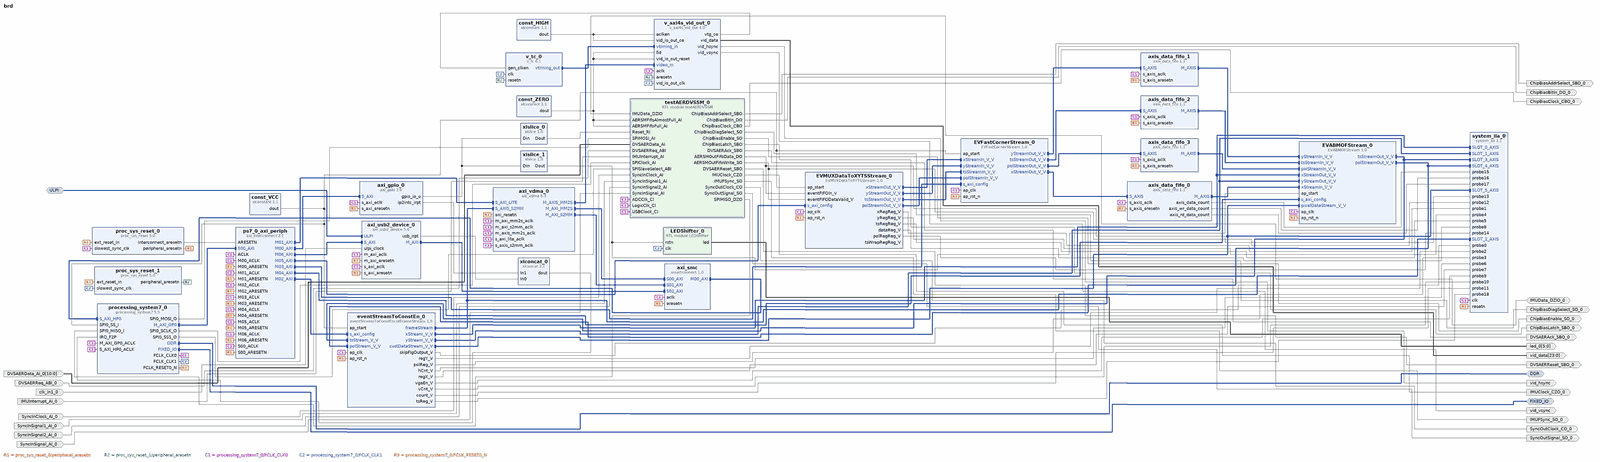
[diagram p0: block diagram of the top level, whole]
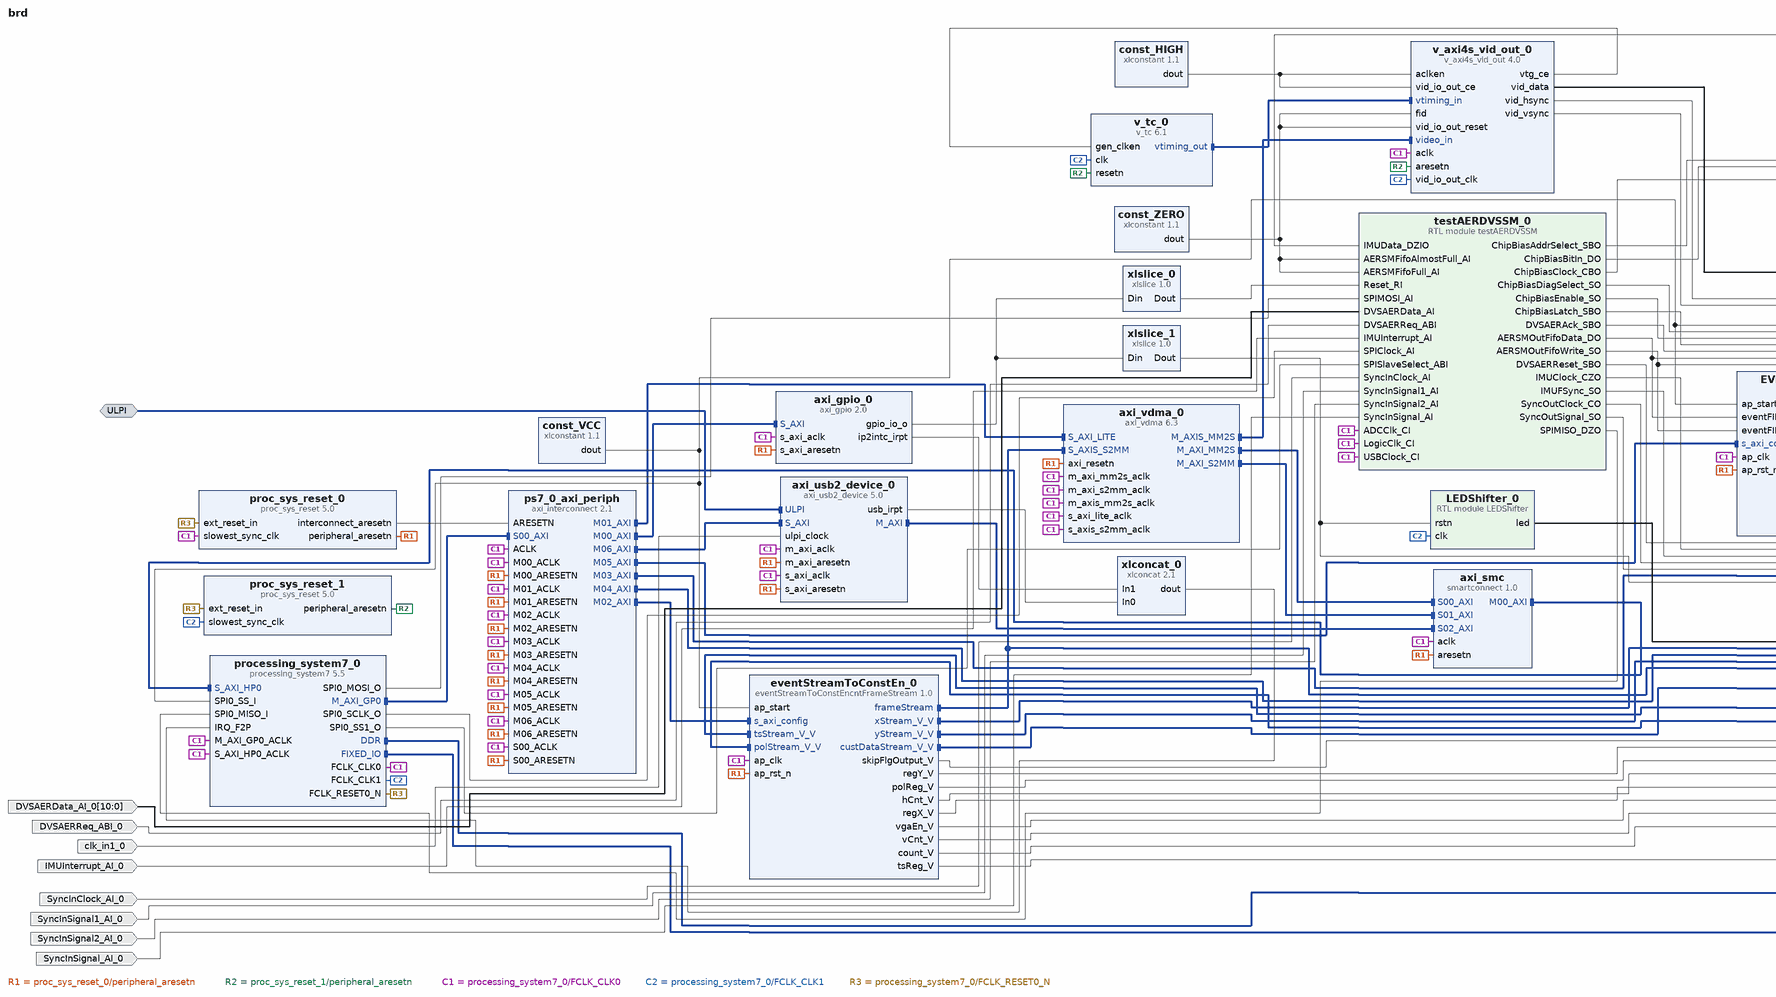
[diagram p1: block diagram of the top level, left part]
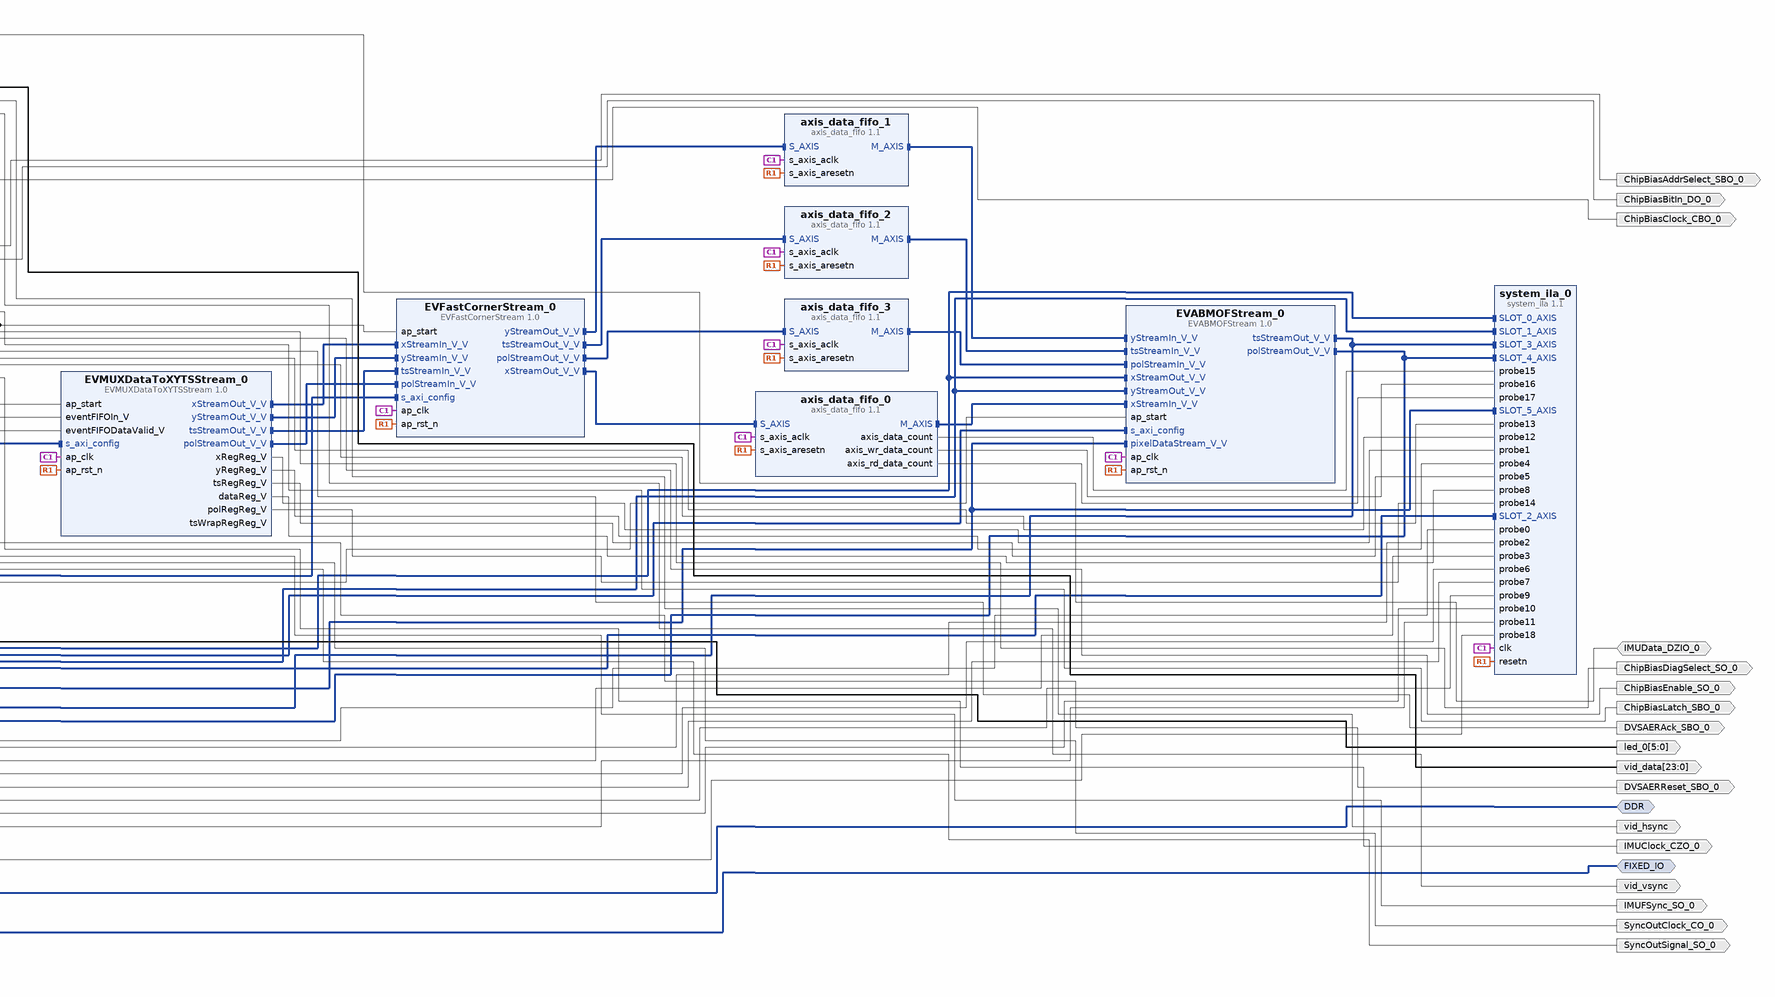
[diagram p2: block diagram of the top level, right part]
# Vivado block design brd, xc7z045ffg900-1, Vivado 2018.1
create_bd_design brd

create_bd_intf_port -mode Master -vlnv xilinx.com:interface:ddrx_rtl:1.0 DDR
create_bd_intf_port -mode Master -vlnv xilinx.com:display_processing_system7:fixedio_rtl:1.0 FIXED_IO
create_bd_intf_port -mode Slave -vlnv xilinx.com:interface:ulpi_rtl:1.0 ULPI
create_bd_port -dir I -from 10 -to 0 DVSAERData_AI_0
create_bd_port -dir I DVSAERReq_ABI_0
create_bd_port -dir I IMUInterrupt_AI_0
create_bd_port -dir O -from 5 -to 0 led_0
create_bd_port -dir IO IMUData_DZIO_0
create_bd_port -dir I SyncInClock_AI_0
create_bd_port -dir I SyncInSignal1_AI_0
create_bd_port -dir I SyncInSignal2_AI_0
create_bd_port -dir I SyncInSignal_AI_0
create_bd_port -dir O ChipBiasAddrSelect_SBO_0
create_bd_port -dir O ChipBiasBitIn_DO_0
create_bd_port -dir O ChipBiasClock_CBO_0
create_bd_port -dir O ChipBiasDiagSelect_SO_0
create_bd_port -dir O ChipBiasEnable_SO_0
create_bd_port -dir O ChipBiasLatch_SBO_0
create_bd_port -dir O DVSAERAck_SBO_0
create_bd_port -dir O DVSAERReset_SBO_0
create_bd_port -dir O IMUClock_CZO_0
create_bd_port -dir O IMUFSync_SO_0
create_bd_port -dir O SyncOutClock_CO_0
create_bd_port -dir O SyncOutSignal_SO_0
create_bd_port -dir O -from 23 -to 0 vid_data
create_bd_port -dir O vid_hsync
create_bd_port -dir O vid_vsync
create_bd_port -dir I -type clk clk_in1_0
set_property -dict {CONFIG.FREQ_HZ 60000000} [get_bd_ports clk_in1_0]

create_bd_cell -type ip -vlnv xilinx.com:ip:axi_gpio:2.0 axi_gpio_0
set_property -dict [list \
  CONFIG.C_GPIO_WIDTH 32 \
  CONFIG.C_IS_DUAL 0 \
  CONFIG.C_DOUT_DEFAULT 0x00000006 \
  CONFIG.C_INTERRUPT_PRESENT 1 \
  CONFIG.C_ALL_OUTPUTS 1 \
] [get_bd_cells axi_gpio_0]
create_bd_cell -type ip -vlnv xilinx.com:ip:axi_vdma:6.3 axi_vdma_0
set_property -dict {CONFIG.c_m_axis_mm2s_tdata_width 24} [get_bd_cells axi_vdma_0]
create_bd_cell -type ip -vlnv xilinx.com:ip:xlconstant:1.1 const_HIGH
create_bd_cell -type ip -vlnv xilinx.com:ip:xlconstant:1.1 const_VCC
create_bd_cell -type ip -vlnv xilinx.com:ip:proc_sys_reset:5.0 proc_sys_reset_0
create_bd_cell -type ip -vlnv xilinx.com:ip:proc_sys_reset:5.0 proc_sys_reset_1
create_bd_cell -type ip -vlnv xilinx.com:ip:processing_system7:5.5 processing_system7_0
set_property -dict [list \
  CONFIG.PCW_FCLK_CLK1_BUF TRUE \
  CONFIG.PCW_FCLK_CLK2_BUF TRUE \
  CONFIG.PCW_UIPARAM_DDR_FREQ_MHZ 533.333333 \
  CONFIG.PCW_CRYSTAL_PERIPHERAL_FREQMHZ 50 \
  CONFIG.PCW_APU_PERIPHERAL_FREQMHZ 666.666666 \
  CONFIG.PCW_SDIO_PERIPHERAL_FREQMHZ 100 \
  CONFIG.PCW_UART_PERIPHERAL_FREQMHZ 100 \
  CONFIG.PCW_SPI_PERIPHERAL_FREQMHZ 125 \
  CONFIG.PCW_I2C_PERIPHERAL_FREQMHZ 108.333336 \
  CONFIG.PCW_FPGA0_PERIPHERAL_FREQMHZ 100 \
  CONFIG.PCW_FPGA1_PERIPHERAL_FREQMHZ 40 \
  CONFIG.PCW_FPGA2_PERIPHERAL_FREQMHZ 250 \
  CONFIG.PCW_USE_S_AXI_HP0 1 \
  CONFIG.PCW_USE_FABRIC_INTERRUPT 1 \
  CONFIG.PCW_EN_CLK1_PORT 1 \
  CONFIG.PCW_EN_CLK2_PORT 1 \
  CONFIG.PCW_IRQ_F2P_INTR 1 \
  CONFIG.PCW_PERIPHERAL_BOARD_PRESET None \
  CONFIG.PCW_PRESET_BANK1_VOLTAGE {LVCMOS 3.3V} \
  CONFIG.PCW_UIPARAM_DDR_BUS_WIDTH {16 Bit} \
  CONFIG.PCW_UIPARAM_DDR_PARTNO Custom \
  CONFIG.PCW_NAND_PERIPHERAL_ENABLE 1 \
  CONFIG.PCW_NAND_NAND_IO {MIO 0 2.. 14} \
  CONFIG.PCW_ENET0_PERIPHERAL_ENABLE 0 \
  CONFIG.PCW_SD0_PERIPHERAL_ENABLE 1 \
  CONFIG.PCW_SD0_SD0_IO {MIO 16 .. 21} \
  CONFIG.PCW_SD0_GRP_CD_ENABLE 0 \
  CONFIG.PCW_SD0_GRP_WP_ENABLE 0 \
  CONFIG.PCW_UART0_PERIPHERAL_ENABLE 1 \
  CONFIG.PCW_UART0_UART0_IO {MIO 22 .. 23} \
  CONFIG.PCW_UART1_PERIPHERAL_ENABLE 0 \
  CONFIG.PCW_SPI0_PERIPHERAL_ENABLE 1 \
  CONFIG.PCW_SPI0_SPI0_IO EMIO \
  CONFIG.PCW_USB0_PERIPHERAL_ENABLE 1 \
  CONFIG.PCW_USB0_USB0_IO {MIO 28 .. 39} \
  CONFIG.PCW_USB1_PERIPHERAL_ENABLE 1 \
  CONFIG.PCW_USB1_USB1_IO {MIO 40 .. 51} \
  CONFIG.PCW_I2C0_PERIPHERAL_ENABLE 1 \
  CONFIG.PCW_I2C0_I2C0_IO {MIO 26 .. 27} \
  CONFIG.PCW_I2C0_GRP_INT_ENABLE 0 \
  CONFIG.PCW_I2C1_PERIPHERAL_ENABLE 1 \
  CONFIG.PCW_I2C1_I2C1_IO EMIO \
  CONFIG.PCW_GPIO_MIO_GPIO_ENABLE 0 \
  CONFIG.PCW_FPGA_FCLK1_ENABLE 1 \
  CONFIG.PCW_FPGA_FCLK2_ENABLE 1 \
] [get_bd_cells processing_system7_0]
# 491 more settings of processing_system7_0 are not shown: defaults, MIO pin electricals, DDR timing, and values the tool derives
create_bd_cell -type ip -vlnv xilinx.com:ip:axi_interconnect:2.1 ps7_0_axi_periph
set_property -dict {CONFIG.NUM_SI 1 CONFIG.NUM_MI 7} [get_bd_cells ps7_0_axi_periph]
create_bd_cell -type ip -vlnv xilinx.com:ip:v_axi4s_vid_out:4.0 v_axi4s_vid_out_0
set_property -dict {CONFIG.C_HAS_ASYNC_CLK 1} [get_bd_cells v_axi4s_vid_out_0]
create_bd_cell -type ip -vlnv xilinx.com:ip:v_tc:6.1 v_tc_0
set_property -dict {CONFIG.HAS_AXI4_LITE false CONFIG.VIDEO_MODE 800x600p CONFIG.enable_detection false} [get_bd_cells v_tc_0]
create_bd_cell -type ip -vlnv xilinx.com:ip:xlslice:1.0 xlslice_0
create_bd_cell -type ip -vlnv xilinx.com:ip:xlslice:1.0 xlslice_1
set_property -dict {CONFIG.DIN_TO 1 CONFIG.DIN_FROM 1 CONFIG.DOUT_WIDTH 1} [get_bd_cells xlslice_1]
create_bd_cell -type ip -vlnv xilinx.com:ip:xlconstant:1.1 const_ZERO
set_property -dict {CONFIG.CONST_VAL 0} [get_bd_cells const_ZERO]
create_bd_cell -type module -reference LEDShifter LEDShifter_0
create_bd_cell -type ip -vlnv xilinx.com:ip:smartconnect:1.0 axi_smc
set_property -dict {CONFIG.NUM_SI 3} [get_bd_cells axi_smc]
create_bd_cell -type module -reference testAERDVSSM testAERDVSSM_0
create_bd_cell -type ip -vlnv xilinx.com:ip:system_ila:1.1 system_ila_0
set_property -dict [list \
  CONFIG.C_SLOT_0_APC_EN 0 \
  CONFIG.C_SLOT_1_APC_EN 0 \
  CONFIG.C_SLOT_2_APC_EN 0 \
  CONFIG.C_SLOT_3_APC_EN 0 \
  CONFIG.C_SLOT_4_APC_EN 0 \
  CONFIG.C_SLOT_5_APC_EN 0 \
  CONFIG.C_SLOT_6_APC_EN 0 \
  CONFIG.C_SLOT_0_AXI_DATA_SEL 1 \
  CONFIG.C_SLOT_1_AXI_DATA_SEL 1 \
  CONFIG.C_SLOT_2_AXI_DATA_SEL 1 \
  CONFIG.C_SLOT_3_AXI_DATA_SEL 1 \
  CONFIG.C_SLOT_4_AXI_DATA_SEL 1 \
  CONFIG.C_SLOT_5_AXI_DATA_SEL 1 \
  CONFIG.C_SLOT_6_AXI_DATA_SEL 1 \
  CONFIG.C_SLOT_0_AXI_TRIG_SEL 1 \
  CONFIG.C_SLOT_1_AXI_TRIG_SEL 1 \
  CONFIG.C_SLOT_2_AXI_TRIG_SEL 1 \
  CONFIG.C_SLOT_3_AXI_TRIG_SEL 1 \
  CONFIG.C_SLOT_4_AXI_TRIG_SEL 1 \
  CONFIG.C_SLOT_5_AXI_TRIG_SEL 1 \
  CONFIG.C_SLOT_6_AXI_TRIG_SEL 1 \
  CONFIG.C_PROBE18_TYPE 0 \
  CONFIG.C_PROBE17_TYPE 0 \
  CONFIG.C_PROBE16_TYPE 0 \
  CONFIG.C_PROBE15_TYPE 0 \
  CONFIG.C_PROBE14_TYPE 0 \
  CONFIG.C_PROBE11_TYPE 0 \
  CONFIG.C_PROBE10_TYPE 0 \
  CONFIG.C_PROBE9_TYPE 0 \
  CONFIG.C_PROBE8_TYPE 0 \
  CONFIG.C_PROBE7_TYPE 0 \
  CONFIG.C_PROBE6_TYPE 0 \
  CONFIG.C_PROBE5_TYPE 0 \
  CONFIG.C_PROBE4_TYPE 0 \
  CONFIG.C_PROBE3_TYPE 0 \
  CONFIG.C_PROBE2_TYPE 0 \
  CONFIG.C_PROBE1_TYPE 0 \
  CONFIG.C_PROBE0_TYPE 0 \
  CONFIG.C_DATA_DEPTH 16384 \
  CONFIG.C_NUM_OF_PROBES 19 \
  CONFIG.C_NUM_MONITOR_SLOTS 6 \
  CONFIG.C_SLOT_0_INTF_TYPE xilinx.com:interface:axis_rtl:1.0 \
  CONFIG.C_SLOT_1_INTF_TYPE xilinx.com:interface:axis_rtl:1.0 \
  CONFIG.C_SLOT_2_INTF_TYPE xilinx.com:interface:axis_rtl:1.0 \
  CONFIG.C_SLOT_3_INTF_TYPE xilinx.com:interface:axis_rtl:1.0 \
  CONFIG.C_SLOT_4_INTF_TYPE xilinx.com:interface:axis_rtl:1.0 \
  CONFIG.C_SLOT_5_INTF_TYPE xilinx.com:interface:axis_rtl:1.0 \
  CONFIG.C_SLOT_6_INTF_TYPE xilinx.com:interface:axis_rtl:1.0 \
  CONFIG.C_MON_TYPE MIX \
] [get_bd_cells system_ila_0]
create_bd_cell -type ip -vlnv xilinx.com:ip:axis_data_fifo:1.1 axis_data_fifo_0
set_property -dict {CONFIG.FIFO_DEPTH 4096} [get_bd_cells axis_data_fifo_0]
create_bd_cell -type ip -vlnv xilinx.com:ip:axis_data_fifo:1.1 axis_data_fifo_1
set_property -dict {CONFIG.FIFO_DEPTH 4096} [get_bd_cells axis_data_fifo_1]
create_bd_cell -type ip -vlnv xilinx.com:ip:axis_data_fifo:1.1 axis_data_fifo_2
set_property -dict {CONFIG.FIFO_DEPTH 4096} [get_bd_cells axis_data_fifo_2]
create_bd_cell -type ip -vlnv xilinx.com:ip:axis_data_fifo:1.1 axis_data_fifo_3
set_property -dict {CONFIG.FIFO_DEPTH 4096} [get_bd_cells axis_data_fifo_3]
create_bd_cell -type ip -vlnv xilinx.com:hls:EVMUXDataToXYTSStream:1.0 EVMUXDataToXYTSStream_0
create_bd_cell -type ip -vlnv xilinx.com:hls:EVFastCornerStream:1.0 EVFastCornerStream_0
create_bd_cell -type ip -vlnv xilinx.com:hls:EVABMOFStream:1.0 EVABMOFStream_0
create_bd_cell -type ip -vlnv xilinx.com:ip:axi_usb2_device:5.0 axi_usb2_device_0
set_property -dict [list \
  CONFIG.C_INCLUDE_DMA 1 \
  CONFIG.C_DMA_UA_TRANS_SUPPORT 1 \
  CONFIG.C_INCLUDE_USBERR_LOGIC 1 \
] [get_bd_cells axi_usb2_device_0]
create_bd_cell -type ip -vlnv xilinx.com:ip:xlconcat:2.1 xlconcat_0
create_bd_cell -type ip -vlnv xilinx.com:hls:eventStreamToConstEncntFrameStream:1.0 eventStreamToConstEn_0

# ---- connections ----

connect_bd_intf_net [get_bd_intf_pins processing_system7_0/M_AXI_GP0] [get_bd_intf_pins ps7_0_axi_periph/S00_AXI]
connect_bd_intf_net [get_bd_intf_pins ps7_0_axi_periph/M00_AXI] [get_bd_intf_pins axi_gpio_0/S_AXI]
connect_bd_intf_net [get_bd_intf_pins ps7_0_axi_periph/M01_AXI] [get_bd_intf_pins axi_vdma_0/S_AXI_LITE]
connect_bd_intf_net [get_bd_intf_pins v_axi4s_vid_out_0/vtiming_in] [get_bd_intf_pins v_tc_0/vtiming_out]
connect_bd_intf_net [get_bd_intf_pins axi_vdma_0/S_AXIS_S2MM] [get_bd_intf_pins eventStreamToConstEn_0/frameStream]
connect_bd_intf_net [get_bd_intf_pins axi_vdma_0/S_AXIS_S2MM] [get_bd_intf_pins system_ila_0/SLOT_2_AXIS]
connect_bd_intf_net [get_bd_intf_pins v_axi4s_vid_out_0/video_in] [get_bd_intf_pins axi_vdma_0/M_AXIS_MM2S]
connect_bd_intf_net [get_bd_intf_pins axi_vdma_0/M_AXI_MM2S] [get_bd_intf_pins axi_smc/S00_AXI]
connect_bd_intf_net [get_bd_intf_pins axi_smc/M00_AXI] [get_bd_intf_pins processing_system7_0/S_AXI_HP0]
connect_bd_intf_net [get_bd_intf_pins axi_vdma_0/M_AXI_S2MM] [get_bd_intf_pins axi_smc/S01_AXI]
connect_bd_intf_net [get_bd_intf_pins ps7_0_axi_periph/M02_AXI] [get_bd_intf_pins eventStreamToConstEn_0/s_axi_config]
connect_bd_intf_net [get_bd_intf_pins EVMUXDataToXYTSStream_0/xStreamOut_V_V] [get_bd_intf_pins EVFastCornerStream_0/xStreamIn_V_V]
connect_bd_intf_net [get_bd_intf_pins EVMUXDataToXYTSStream_0/yStreamOut_V_V] [get_bd_intf_pins EVFastCornerStream_0/yStreamIn_V_V]
connect_bd_intf_net [get_bd_intf_pins EVMUXDataToXYTSStream_0/tsStreamOut_V_V] [get_bd_intf_pins EVFastCornerStream_0/tsStreamIn_V_V]
connect_bd_intf_net [get_bd_intf_pins EVMUXDataToXYTSStream_0/polStreamOut_V_V] [get_bd_intf_pins EVFastCornerStream_0/polStreamIn_V_V]
connect_bd_intf_net [get_bd_intf_pins ps7_0_axi_periph/M03_AXI] [get_bd_intf_pins EVFastCornerStream_0/s_axi_config]
connect_bd_intf_net [get_bd_intf_pins ps7_0_axi_periph/M04_AXI] [get_bd_intf_pins EVABMOFStream_0/s_axi_config]
connect_bd_intf_net [get_bd_intf_pins eventStreamToConstEn_0/xStream_V_V] [get_bd_intf_pins EVABMOFStream_0/xStreamOut_V_V]
connect_bd_intf_net [get_bd_intf_pins eventStreamToConstEn_0/xStream_V_V] [get_bd_intf_pins system_ila_0/SLOT_0_AXIS]
connect_bd_intf_net [get_bd_intf_pins eventStreamToConstEn_0/yStream_V_V] [get_bd_intf_pins EVABMOFStream_0/yStreamOut_V_V]
connect_bd_intf_net [get_bd_intf_pins eventStreamToConstEn_0/yStream_V_V] [get_bd_intf_pins system_ila_0/SLOT_1_AXIS]
connect_bd_intf_net [get_bd_intf_pins EVABMOFStream_0/tsStreamOut_V_V] [get_bd_intf_pins eventStreamToConstEn_0/tsStream_V_V]
connect_bd_intf_net [get_bd_intf_pins EVABMOFStream_0/tsStreamOut_V_V] [get_bd_intf_pins system_ila_0/SLOT_3_AXIS]
connect_bd_intf_net [get_bd_intf_pins EVABMOFStream_0/polStreamOut_V_V] [get_bd_intf_pins eventStreamToConstEn_0/polStream_V_V]
connect_bd_intf_net [get_bd_intf_pins EVABMOFStream_0/polStreamOut_V_V] [get_bd_intf_pins system_ila_0/SLOT_4_AXIS]
connect_bd_intf_net [get_bd_intf_pins eventStreamToConstEn_0/custDataStream_V_V] [get_bd_intf_pins EVABMOFStream_0/pixelDataStream_V_V]
connect_bd_intf_net [get_bd_intf_pins eventStreamToConstEn_0/custDataStream_V_V] [get_bd_intf_pins system_ila_0/SLOT_5_AXIS]
connect_bd_intf_net [get_bd_intf_pins EVFastCornerStream_0/xStreamOut_V_V] [get_bd_intf_pins axis_data_fifo_0/S_AXIS]
connect_bd_intf_net [get_bd_intf_pins EVFastCornerStream_0/yStreamOut_V_V] [get_bd_intf_pins axis_data_fifo_1/S_AXIS]
connect_bd_intf_net [get_bd_intf_pins EVFastCornerStream_0/tsStreamOut_V_V] [get_bd_intf_pins axis_data_fifo_2/S_AXIS]
connect_bd_intf_net [get_bd_intf_pins EVFastCornerStream_0/polStreamOut_V_V] [get_bd_intf_pins axis_data_fifo_3/S_AXIS]
connect_bd_intf_net [get_bd_intf_pins axis_data_fifo_0/M_AXIS] [get_bd_intf_pins EVABMOFStream_0/xStreamIn_V_V]
connect_bd_intf_net [get_bd_intf_pins axis_data_fifo_1/M_AXIS] [get_bd_intf_pins EVABMOFStream_0/yStreamIn_V_V]
connect_bd_intf_net [get_bd_intf_pins axis_data_fifo_2/M_AXIS] [get_bd_intf_pins EVABMOFStream_0/tsStreamIn_V_V]
connect_bd_intf_net [get_bd_intf_pins axis_data_fifo_3/M_AXIS] [get_bd_intf_pins EVABMOFStream_0/polStreamIn_V_V]
connect_bd_intf_net [get_bd_intf_pins ps7_0_axi_periph/M05_AXI] [get_bd_intf_pins EVMUXDataToXYTSStream_0/s_axi_config]
connect_bd_intf_net [get_bd_intf_pins ps7_0_axi_periph/M06_AXI] [get_bd_intf_pins axi_usb2_device_0/S_AXI]
connect_bd_intf_net [get_bd_intf_pins axi_usb2_device_0/M_AXI] [get_bd_intf_pins axi_smc/S02_AXI]
connect_bd_intf_net [get_bd_intf_ports DDR] [get_bd_intf_pins processing_system7_0/DDR]
connect_bd_intf_net [get_bd_intf_ports FIXED_IO] [get_bd_intf_pins processing_system7_0/FIXED_IO]
connect_bd_intf_net -intf_net ULPI_0_1 [get_bd_intf_ports ULPI] [get_bd_intf_pins axi_usb2_device_0/ULPI]
connect_bd_net -net DVSAERData_AI_0_1 [get_bd_ports DVSAERData_AI_0] [get_bd_pins testAERDVSSM_0/DVSAERData_AI]
connect_bd_net -net DVSAERReq_ABI_0_1 [get_bd_ports DVSAERReq_ABI_0] [get_bd_pins testAERDVSSM_0/DVSAERReq_ABI]
connect_bd_net -net IMUInterrupt_AI_0_1 [get_bd_ports IMUInterrupt_AI_0] [get_bd_pins testAERDVSSM_0/IMUInterrupt_AI]
connect_bd_net [get_bd_pins LEDShifter_0/led] [get_bd_ports led_0]
connect_bd_net [get_bd_ports IMUData_DZIO_0] [get_bd_pins testAERDVSSM_0/IMUData_DZIO]
connect_bd_net [get_bd_pins const_HIGH/dout] [get_bd_pins v_axi4s_vid_out_0/vid_io_out_ce] [get_bd_pins v_axi4s_vid_out_0/aclken]
connect_bd_net -net SyncInClock_AI_0_1 [get_bd_ports SyncInClock_AI_0] [get_bd_pins testAERDVSSM_0/SyncInClock_AI]
connect_bd_net -net SyncInSignal1_AI_0_1 [get_bd_ports SyncInSignal1_AI_0] [get_bd_pins testAERDVSSM_0/SyncInSignal1_AI]
connect_bd_net -net SyncInSignal2_AI_0_1 [get_bd_ports SyncInSignal2_AI_0] [get_bd_pins testAERDVSSM_0/SyncInSignal2_AI]
connect_bd_net -net SyncInSignal_AI_0_1 [get_bd_ports SyncInSignal_AI_0] [get_bd_pins testAERDVSSM_0/SyncInSignal_AI]
connect_bd_net [get_bd_pins axi_gpio_0/gpio_io_o] [get_bd_pins xlslice_0/Din] [get_bd_pins xlslice_1/Din]
connect_bd_net [get_bd_pins const_VCC/dout] \
  [get_bd_pins processing_system7_0/SPI0_SS_I] [get_bd_pins EVMUXDataToXYTSStream_0/ap_start] \
  [get_bd_pins EVFastCornerStream_0/ap_start] [get_bd_pins eventStreamToConstEn_0/ap_start]
connect_bd_net [get_bd_pins proc_sys_reset_0/interconnect_aresetn] [get_bd_pins ps7_0_axi_periph/ARESETN]
connect_bd_net [get_bd_pins proc_sys_reset_0/peripheral_aresetn] \
  [get_bd_pins axi_gpio_0/s_axi_aresetn] [get_bd_pins axi_vdma_0/axi_resetn] [get_bd_pins axi_smc/aresetn] \
  [get_bd_pins system_ila_0/resetn] [get_bd_pins axis_data_fifo_0/s_axis_aresetn] \
  [get_bd_pins axis_data_fifo_1/s_axis_aresetn] [get_bd_pins axis_data_fifo_2/s_axis_aresetn] \
  [get_bd_pins axis_data_fifo_3/s_axis_aresetn] [get_bd_pins EVMUXDataToXYTSStream_0/ap_rst_n] \
  [get_bd_pins EVFastCornerStream_0/ap_rst_n] [get_bd_pins EVABMOFStream_0/ap_rst_n] \
  [get_bd_pins axi_usb2_device_0/s_axi_aresetn] [get_bd_pins axi_usb2_device_0/m_axi_aresetn] \
  [get_bd_pins ps7_0_axi_periph/S00_ARESETN] [get_bd_pins ps7_0_axi_periph/M00_ARESETN] \
  [get_bd_pins ps7_0_axi_periph/M01_ARESETN] [get_bd_pins ps7_0_axi_periph/M02_ARESETN] \
  [get_bd_pins ps7_0_axi_periph/M03_ARESETN] [get_bd_pins ps7_0_axi_periph/M04_ARESETN] \
  [get_bd_pins ps7_0_axi_periph/M05_ARESETN] [get_bd_pins ps7_0_axi_periph/M06_ARESETN] \
  [get_bd_pins eventStreamToConstEn_0/ap_rst_n]
connect_bd_net [get_bd_pins proc_sys_reset_1/peripheral_aresetn] [get_bd_pins v_tc_0/resetn] [get_bd_pins v_axi4s_vid_out_0/aresetn]
connect_bd_net [get_bd_pins processing_system7_0/FCLK_CLK0] \
  [get_bd_pins proc_sys_reset_0/slowest_sync_clk] [get_bd_pins processing_system7_0/M_AXI_GP0_ACLK] \
  [get_bd_pins axi_gpio_0/s_axi_aclk] [get_bd_pins axi_vdma_0/m_axi_mm2s_aclk] \
  [get_bd_pins processing_system7_0/S_AXI_HP0_ACLK] [get_bd_pins axi_vdma_0/s_axi_lite_aclk] \
  [get_bd_pins v_axi4s_vid_out_0/aclk] [get_bd_pins axi_vdma_0/m_axi_s2mm_aclk] [get_bd_pins axi_vdma_0/s_axis_s2mm_aclk] \
  [get_bd_pins axi_vdma_0/m_axis_mm2s_aclk] [get_bd_pins axi_smc/aclk] [get_bd_pins testAERDVSSM_0/USBClock_CI] \
  [get_bd_pins testAERDVSSM_0/LogicClk_CI] [get_bd_pins testAERDVSSM_0/ADCClk_CI] [get_bd_pins system_ila_0/clk] \
  [get_bd_pins axis_data_fifo_0/s_axis_aclk] [get_bd_pins axis_data_fifo_1/s_axis_aclk] \
  [get_bd_pins axis_data_fifo_2/s_axis_aclk] [get_bd_pins axis_data_fifo_3/s_axis_aclk] \
  [get_bd_pins EVMUXDataToXYTSStream_0/ap_clk] [get_bd_pins EVFastCornerStream_0/ap_clk] [get_bd_pins EVABMOFStream_0/ap_clk] \
  [get_bd_pins axi_usb2_device_0/s_axi_aclk] [get_bd_pins axi_usb2_device_0/m_axi_aclk] \
  [get_bd_pins ps7_0_axi_periph/S00_ACLK] [get_bd_pins ps7_0_axi_periph/M00_ACLK] [get_bd_pins ps7_0_axi_periph/ACLK] \
  [get_bd_pins ps7_0_axi_periph/M01_ACLK] [get_bd_pins ps7_0_axi_periph/M02_ACLK] [get_bd_pins ps7_0_axi_periph/M03_ACLK] \
  [get_bd_pins ps7_0_axi_periph/M04_ACLK] [get_bd_pins ps7_0_axi_periph/M05_ACLK] [get_bd_pins ps7_0_axi_periph/M06_ACLK] \
  [get_bd_pins eventStreamToConstEn_0/ap_clk]
connect_bd_net [get_bd_pins processing_system7_0/FCLK_CLK1] \
  [get_bd_pins proc_sys_reset_1/slowest_sync_clk] [get_bd_pins v_tc_0/clk] [get_bd_pins v_axi4s_vid_out_0/vid_io_out_clk] \
  [get_bd_pins LEDShifter_0/clk]
connect_bd_net [get_bd_pins processing_system7_0/FCLK_RESET0_N] \
  [get_bd_pins proc_sys_reset_0/ext_reset_in] [get_bd_pins proc_sys_reset_1/ext_reset_in]
connect_bd_net [get_bd_pins testAERDVSSM_0/AERSMOutFifoData_DO] [get_bd_pins system_ila_0/probe13] [get_bd_pins EVMUXDataToXYTSStream_0/eventFIFOIn_V]
connect_bd_net [get_bd_pins testAERDVSSM_0/AERSMOutFifoWrite_SO] \
  [get_bd_pins system_ila_0/probe12] [get_bd_pins EVMUXDataToXYTSStream_0/eventFIFODataValid_V]
connect_bd_net [get_bd_pins testAERDVSSM_0/ChipBiasAddrSelect_SBO] [get_bd_ports ChipBiasAddrSelect_SBO_0]
connect_bd_net [get_bd_pins testAERDVSSM_0/ChipBiasBitIn_DO] [get_bd_ports ChipBiasBitIn_DO_0]
connect_bd_net [get_bd_pins testAERDVSSM_0/ChipBiasClock_CBO] [get_bd_ports ChipBiasClock_CBO_0]
connect_bd_net [get_bd_pins testAERDVSSM_0/ChipBiasDiagSelect_SO] [get_bd_ports ChipBiasDiagSelect_SO_0]
connect_bd_net [get_bd_pins testAERDVSSM_0/ChipBiasEnable_SO] [get_bd_ports ChipBiasEnable_SO_0]
connect_bd_net [get_bd_pins testAERDVSSM_0/ChipBiasLatch_SBO] [get_bd_ports ChipBiasLatch_SBO_0]
connect_bd_net [get_bd_pins testAERDVSSM_0/DVSAERAck_SBO] [get_bd_ports DVSAERAck_SBO_0]
connect_bd_net [get_bd_pins testAERDVSSM_0/DVSAERReset_SBO] [get_bd_ports DVSAERReset_SBO_0]
connect_bd_net [get_bd_pins testAERDVSSM_0/IMUClock_CZO] [get_bd_ports IMUClock_CZO_0]
connect_bd_net [get_bd_pins testAERDVSSM_0/IMUFSync_SO] [get_bd_ports IMUFSync_SO_0]
connect_bd_net [get_bd_pins testAERDVSSM_0/SyncOutClock_CO] [get_bd_ports SyncOutClock_CO_0]
connect_bd_net [get_bd_pins testAERDVSSM_0/SyncOutSignal_SO] [get_bd_ports SyncOutSignal_SO_0]
connect_bd_net [get_bd_pins v_axi4s_vid_out_0/vid_data] [get_bd_ports vid_data]
connect_bd_net [get_bd_pins v_axi4s_vid_out_0/vid_hsync] [get_bd_ports vid_hsync]
connect_bd_net [get_bd_pins v_axi4s_vid_out_0/vid_vsync] [get_bd_ports vid_vsync]
connect_bd_net [get_bd_pins v_axi4s_vid_out_0/vtg_ce] [get_bd_pins v_tc_0/gen_clken]
connect_bd_net [get_bd_pins xlslice_0/Dout] [get_bd_pins testAERDVSSM_0/Reset_RI]
connect_bd_net [get_bd_pins xlslice_1/Dout] [get_bd_pins LEDShifter_0/rstn] [get_bd_pins EVABMOFStream_0/ap_start]
connect_bd_net [get_bd_pins const_ZERO/dout] \
  [get_bd_pins v_axi4s_vid_out_0/vid_io_out_reset] [get_bd_pins v_axi4s_vid_out_0/fid] \
  [get_bd_pins testAERDVSSM_0/AERSMFifoFull_AI] [get_bd_pins testAERDVSSM_0/AERSMFifoAlmostFull_AI]
connect_bd_net [get_bd_pins processing_system7_0/SPI0_MOSI_O] [get_bd_pins testAERDVSSM_0/SPIMOSI_AI]
connect_bd_net [get_bd_pins testAERDVSSM_0/SPIMISO_DZO] [get_bd_pins processing_system7_0/SPI0_MISO_I]
connect_bd_net [get_bd_pins processing_system7_0/SPI0_SCLK_O] [get_bd_pins testAERDVSSM_0/SPIClock_AI]
connect_bd_net [get_bd_pins processing_system7_0/SPI0_SS1_O] [get_bd_pins testAERDVSSM_0/SPISlaveSelect_ABI]
connect_bd_net -net skipFlgOutput_V [get_bd_pins eventStreamToConstEn_0/skipFlgOutput_V] [get_bd_pins system_ila_0/probe0]
connect_bd_net -net xRegReg_V [get_bd_pins EVMUXDataToXYTSStream_0/xRegReg_V] [get_bd_pins system_ila_0/probe1]
connect_bd_net -net regY_V [get_bd_pins eventStreamToConstEn_0/regY_V] [get_bd_pins system_ila_0/probe2]
connect_bd_net -net polReg_V [get_bd_pins eventStreamToConstEn_0/polReg_V] [get_bd_pins system_ila_0/probe3]
connect_bd_net -net yRegReg_V [get_bd_pins EVMUXDataToXYTSStream_0/yRegReg_V] [get_bd_pins system_ila_0/probe4]
connect_bd_net -net tsRegReg_V [get_bd_pins EVMUXDataToXYTSStream_0/tsRegReg_V] [get_bd_pins system_ila_0/probe5]
connect_bd_net -net hCnt_V [get_bd_pins eventStreamToConstEn_0/hCnt_V] [get_bd_pins system_ila_0/probe6]
connect_bd_net -net regX_V [get_bd_pins eventStreamToConstEn_0/regX_V] [get_bd_pins system_ila_0/probe7]
connect_bd_net -net dataReg_V [get_bd_pins EVMUXDataToXYTSStream_0/dataReg_V] [get_bd_pins system_ila_0/probe8]
connect_bd_net -net vgaEn_V [get_bd_pins eventStreamToConstEn_0/vgaEn_V] [get_bd_pins system_ila_0/probe9]
connect_bd_net -net vCnt_V [get_bd_pins eventStreamToConstEn_0/vCnt_V] [get_bd_pins system_ila_0/probe10]
connect_bd_net -net count_V [get_bd_pins eventStreamToConstEn_0/count_V] [get_bd_pins system_ila_0/probe11]
connect_bd_net -net polRegReg_V [get_bd_pins EVMUXDataToXYTSStream_0/polRegReg_V] [get_bd_pins system_ila_0/probe14]
# net tsWrapRegReg_V has one end: EVMUXDataToXYTSStream_0/tsWrapRegReg_V
connect_bd_net -net axis_data_count [get_bd_pins axis_data_fifo_0/axis_data_count] [get_bd_pins system_ila_0/probe15]
connect_bd_net -net axis_wr_data_count [get_bd_pins axis_data_fifo_0/axis_wr_data_count] [get_bd_pins system_ila_0/probe16]
connect_bd_net -net axis_rd_data_count [get_bd_pins axis_data_fifo_0/axis_rd_data_count] [get_bd_pins system_ila_0/probe17]
connect_bd_net -net tsReg_V [get_bd_pins eventStreamToConstEn_0/tsReg_V] [get_bd_pins system_ila_0/probe18]
connect_bd_net [get_bd_pins axi_usb2_device_0/usb_irpt] [get_bd_pins xlconcat_0/In0]
connect_bd_net [get_bd_pins axi_gpio_0/ip2intc_irpt] [get_bd_pins xlconcat_0/In1]
connect_bd_net [get_bd_pins xlconcat_0/dout] [get_bd_pins processing_system7_0/IRQ_F2P]
connect_bd_net -net ulpi_clock_0_1 [get_bd_ports clk_in1_0] [get_bd_pins axi_usb2_device_0/ulpi_clock]

# ---- address map ----
assign_bd_address -offset 0x00000000 -range 512M -target_address_space [get_bd_addr_spaces axi_usb2_device_0/DMA_DATA] [get_bd_addr_segs processing_system7_0/S_AXI_HP0/HP0_DDR_LOWOCM]
assign_bd_address -offset 0x00000000 -range 512M -target_address_space [get_bd_addr_spaces axi_vdma_0/Data_MM2S] [get_bd_addr_segs processing_system7_0/S_AXI_HP0/HP0_DDR_LOWOCM]
assign_bd_address -offset 0x00000000 -range 512M -target_address_space [get_bd_addr_spaces axi_vdma_0/Data_S2MM] [get_bd_addr_segs processing_system7_0/S_AXI_HP0/HP0_DDR_LOWOCM]
assign_bd_address -offset 0x41200000 -range 64K -target_address_space [get_bd_addr_spaces processing_system7_0/Data] [get_bd_addr_segs axi_gpio_0/S_AXI/Reg]
assign_bd_address -offset 0x42E00000 -range 64K -target_address_space [get_bd_addr_spaces processing_system7_0/Data] [get_bd_addr_segs axi_usb2_device_0/S_AXI/Reg]
assign_bd_address -offset 0x43000000 -range 64K -target_address_space [get_bd_addr_spaces processing_system7_0/Data] [get_bd_addr_segs axi_vdma_0/S_AXI_LITE/Reg]
assign_bd_address -offset 0x43C00000 -range 64K -target_address_space [get_bd_addr_spaces processing_system7_0/Data] [get_bd_addr_segs eventStreamToConstEn_0/s_axi_config/Reg]
assign_bd_address -offset 0x43C10000 -range 64K -target_address_space [get_bd_addr_spaces processing_system7_0/Data] [get_bd_addr_segs EVFastCornerStream_0/s_axi_config/Reg]
assign_bd_address -offset 0x43C20000 -range 64K -target_address_space [get_bd_addr_spaces processing_system7_0/Data] [get_bd_addr_segs EVABMOFStream_0/s_axi_config/Reg]
assign_bd_address -offset 0x43C30000 -range 64K -target_address_space [get_bd_addr_spaces processing_system7_0/Data] [get_bd_addr_segs EVMUXDataToXYTSStream_0/s_axi_config/Reg]

validate_bd_design
save_bd_design
